# EAGLE design tester (EAGLE 9.2.2)
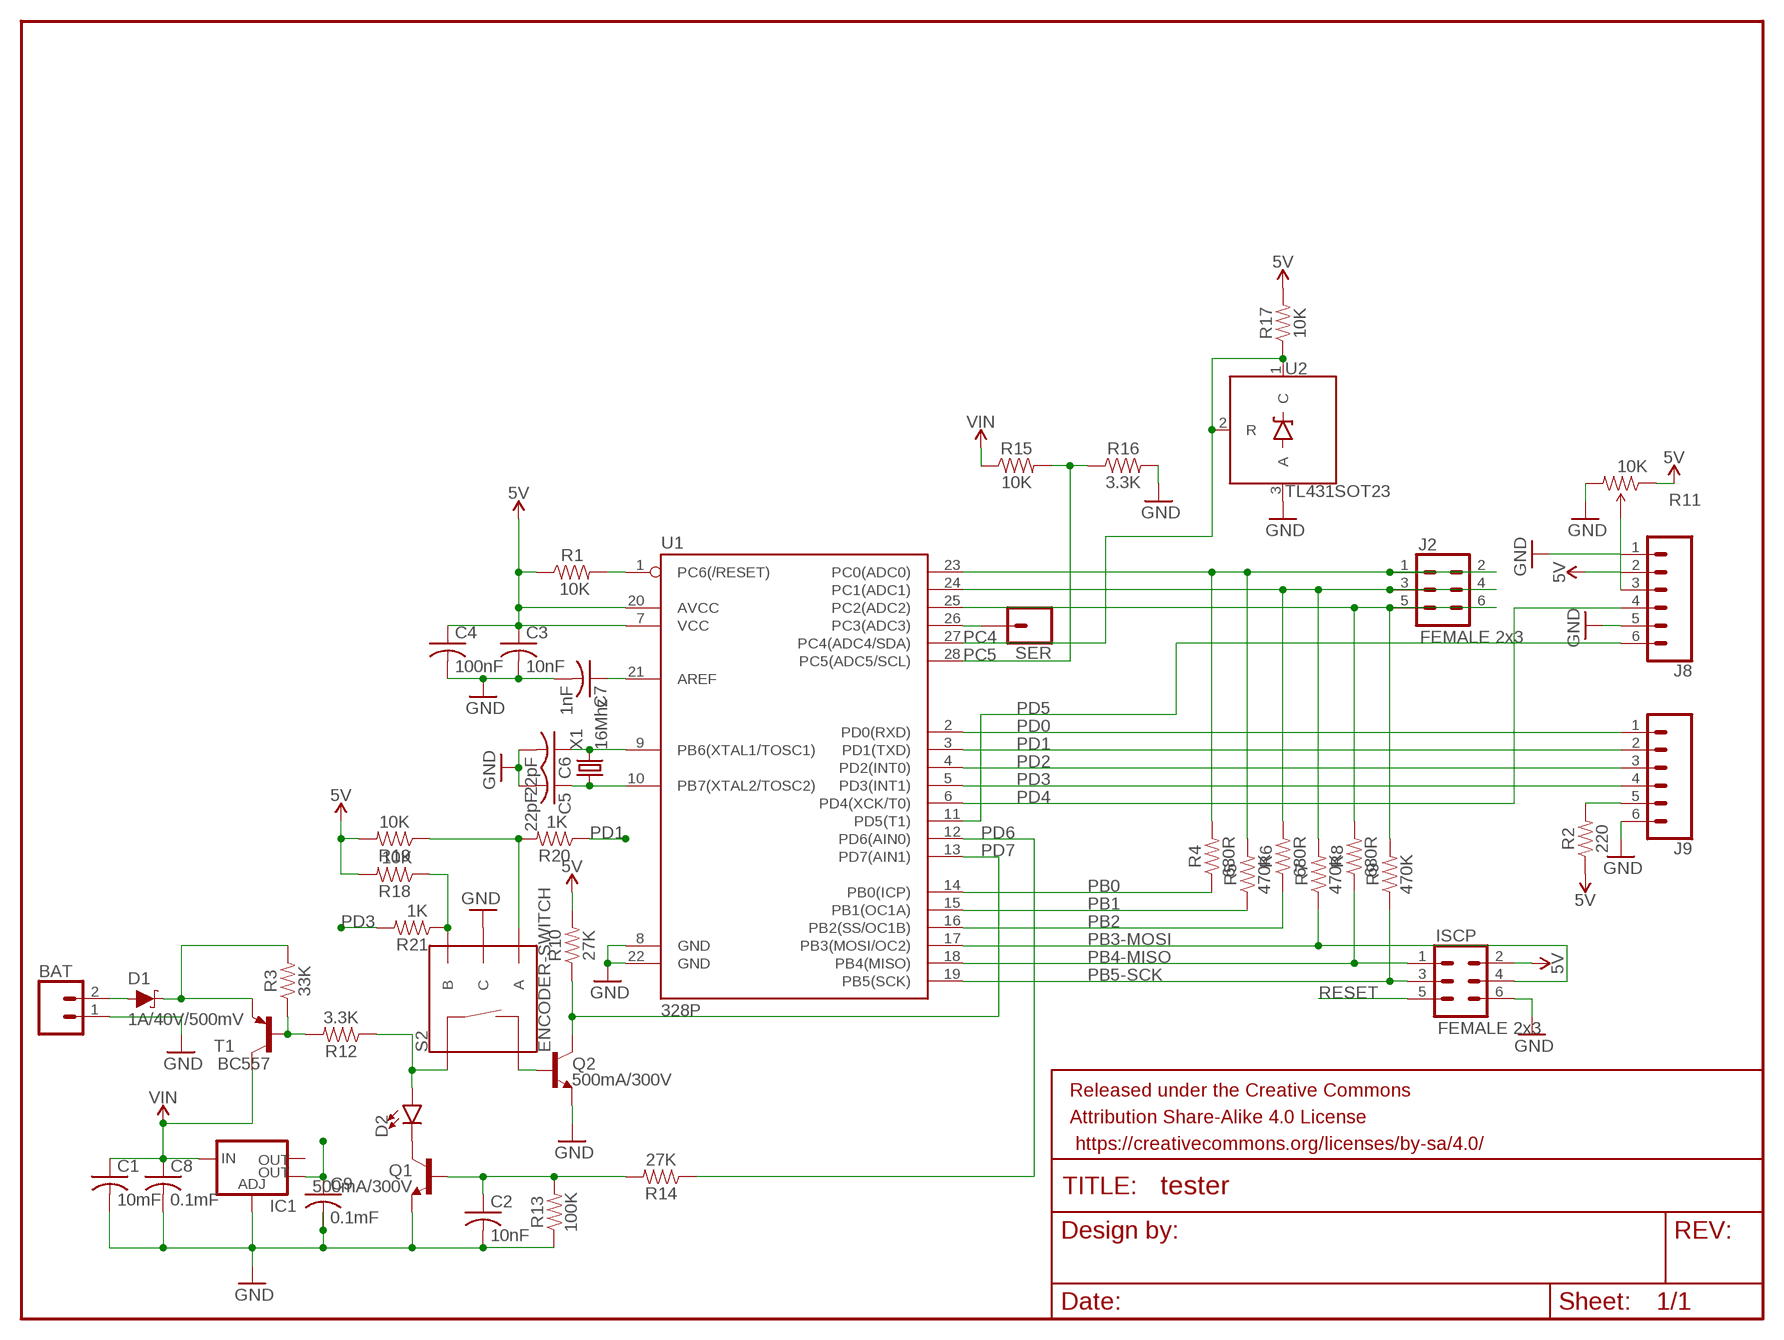
[diagram p0: schematic, sheet 1]

## Parts
BAT  CONN_02  [1X02]
C1  10mF  C-USC0805  [C0805]
C2  10nF  C-USC0805  [C0805]
C3  10nF  C-USC0805  [C0805]
C4  100nF  C-USC0805  [C0805]
C5  22pF  C-USC0805  [C0805]
C6  22pF  C-USC0805  [C0805]
C7  1nF  C-USC0805  [C0805]
C8  0.1mF  C-USC0805  [C0805]
C9  0.1mF  C-USC0805  [C0805]
D1  1A/40V/500mV  DIODE-SCHOTTKY-SS14  [SMA-DIODE]
D2  LED3MM  [LED_3MM]
FRAME1  FRAME-LETTER  [CREATIVE_COMMONS]
IC1  V_REG_LM1117SOT223  [SOT223]
ISCP  FEMALE 2x3  CONN_03X2FEMALE  [2X3]
J2  FEMALE 2x3  CONN_03X2FEMALE  [2X3]
J8  CONN_06SILK_FEMALE_PTH  [1X06]
J9  CONN_06SILK_FEMALE_PTH  [1X06]
Q1  500mA/300V  TRANS_NPN-MMBTA42  [SOT23-3]
Q2  500mA/300V  TRANS_NPN-MMBTA42  [SOT23-3]
R1  10K  RESISTOR0805  [0805]
R2  220  RESISTOR1206  [1206]
R3  33K  RESISTOR1206  [1206]
R4  680R  RESISTORAXIAL-0.3  [AXIAL-0.3]
R5  470K  RESISTORAXIAL-0.3  [AXIAL-0.3]
R6  680R  RESISTORAXIAL-0.3  [AXIAL-0.3]
R7  470K  RESISTORAXIAL-0.3  [AXIAL-0.3]
R8  680R  RESISTORAXIAL-0.3  [AXIAL-0.3]
R9  470K  RESISTORAXIAL-0.3  [AXIAL-0.3]
R10  27K  RESISTOR1206  [1206]
R11  10K  TRIMPOTPTH  [TRIM_POT_PTH]
R12  3.3K  RESISTOR1206  [1206]
R13  100K  RESISTOR0805  [0805]
R14  27K  RESISTOR1206  [1206]
R15  10K  RESISTOR1206  [1206]
R16  3.3K  RESISTOR1206  [1206]
R17  10K  RESISTOR0805  [0805]
R18  10K  RESISTOR0805  [0805]
R19  10K  RESISTOR0805  [0805]
R20  1K  RESISTOR0805  [0805]
R21  1K  RESISTOR0805  [0805]
S2  ENCODER-SWITCH  [ROTARY_ENC_PLAIN]
SER  CONN_01  [1X01]
T1  BC557  BC557A-PNP-TO92-EBC  [TO92-EBC]
U1  328P  ATMEGA328P_PDIP  [DIP28]
U2  TL431SOT23  [SOT23-3]
X1  16Mhz  CRYSTALS-NOGND-HC49  [HC49]

## Nets
5V: C3.1 C4.1 C9.1 IC1.4(OUT) ISCP.2 J8.2 R1.1 R2.1 R10.2 R11.1(CCW) R17.2 R18.2 R19.2 U1.7(VCC) U1.20(AVCC)
GND: BAT.1 C1.2 C2.2 C3.2 C4.2 C5.2 C6.2 C7.2 C8.2 C9.2 IC1.1(ADJ) ISCP.6 J8.1 J8.5 J9.6 Q1.2(E) Q2.2(E) R11.3(CW) R13.1 R16.2 S2.C U1.8(GND) U1.22(GND) U2.3(A)
N$2: C6.1 U1.9(PB6(XTAL1/TOSC1)) X1.2
N$3: C5.1 U1.10(PB7(XTAL2/TOSC2)) X1.1
N$5: C7.1 U1.21(AREF)
N$10: J9.5 R2.2
N$11: J8.3 R11.2(WIPER)
N$13: D2.K(C) Q1.3(C)
N$14: R18.1 R21.1 S2.B
N$18: BAT.2 D1.A
N$20: R3.1 R12.2 T1.B
N$22: C2.1 Q1.1(B) R13.2 R14.2
N$23: D1.C R3.2 T1.E
N$24: D2.A R12.1 S2.SW+
N$25: R19.1 R20.2 S2.A
N$26: Q2.1(B) S2.SW-
PB0: R4.P$1 U1.14(PB0(ICP))
PB1: R5.P$1 U1.15(PB1(OC1A))
PB2: R6.P$1 U1.16(PB2(SS/OC1B))
PB3-MOSI: ISCP.4 R7.P$1 U1.17(PB3(MOSI/OC2))
PB4-MISO: ISCP.1 R8.P$1 U1.18(PB4(MISO))
PB5-SCK: ISCP.3 R9.P$1 U1.19(PB5(SCK))
PC4: R17.1 U1.27(PC4(ADC4/SDA)) U2.1(C) U2.2(R)
PC5: R15.2 R16.1 U1.28(PC5(ADC5/SCL))
PD0: J9.1 U1.2(PD0(RXD))
PD1: J9.2 R20.1 U1.3(PD1(TXD))
PD2: J9.3 U1.4(PD2(INT0))
PD3: J9.4 R21.2 U1.5(PD3(INT1))
PD4: J8.4 U1.6(PD4(XCK/T0))
PD5: J8.6 U1.11(PD5(T1))
PD6: R14.1 U1.12(PD6(AIN0))
PD7: Q2.3(C) R10.1 U1.13(PD7(AIN1))
RESET: ISCP.5 R1.2 U1.1(PC6(/RESET))
SERIAL: SER.1 U1.26(PC3(ADC3))
TP1: J2.1 J2.2 R4.P$2 R5.P$2 U1.23(PC0(ADC0))
TP2: J2.3 J2.4 R6.P$2 R7.P$2 U1.24(PC1(ADC1))
TP3: J2.5 J2.6 R8.P$2 R9.P$2 U1.25(PC2(ADC2))
VIN: C1.1 C8.1 IC1.3(IN) R15.1 T1.C
Unconnected: IC1.2(OUT)

## Library data of the parts
BAT = SparkFun-Connectors:CONN_02: Multi connection point. Often used as Generic Header-pin footprint for 0.1 inch spaced/style header connections On any of the 0.1 inch spaced packages, you can populate with these: Break Away Headers - Straight <https://www.sparkfun.com/products/116> (PRT-00116) Break Away Male Headers - Right Angle <https://www.sparkfun.com/products/553> (PRT-00553) Female Headers <https://www.sparkfun.com/products/115> (PRT-00115) Break Away Headers - Machine Pin <https://www.sparkfun.com/products/117> (PRT-00117) Break Away Female Headers - Swiss Machine Pin <https://www.sparkfun.com/products/743> (PRT-00743) For SCREWTERMINALS and SPRING TERMINALS visit here: Screw Terimnals on SparkFun.com <https://www.sparkfun.com/search/results?term=Screw+Terminals> (5mm/3.5mm/2.54mm spacing) This device is also useful as a general connection point to wire up your design to another part of your project. Our various solder wires solder well into these plated through hole pads. Hook-Up Wire - Assortment (Stranded, 22 AWG) <https://www.sparkfun.com/products/11375> (PRT-11375) Hook-Up Wire - Assortment (Solid Core, 22 AWG) <https://www.sparkfun.com/products/11367> (PRT-11367) View the entire wire category on our website here <https://www.sparkfun.com/categories/141> Special notes: Molex polarized connector foot print use with: PRT-08233 with associated crimp pins and housings. 2.54_SCREWTERM for use with PRT-10571. 3.5mm Screw Terminal footprints for PRT-08084 5mm Screw Terminal footprints for use with PRT-08432
C1-C9 = rcl:C-US: CAPACITOR, American symbol; SPICEPREFIX: C
D1 = SparkFun-DiscreteSemi:DIODE-SCHOTTKY: Schottky diode A Schottky diode is a semiconductor diode which has a low forward voltage drop and a very fast switching action.; PROD_ID: DIO-08053
D2 = SparkFun-LED:LED: LED (Generic) Standard schematic elements and footprints for 5mm, 3mm, 1206, and 0603 sized LEDs. Generic LEDs with no color specified.; PROD_ID: DIO-08794
FRAME1 = SparkFun-Aesthetics:FRAME-LETTER: Schematic Frame - Letter Standard 8.5x11 US Letter frame
IC1 = SparkFun-IC-Power:V_REG_LM1117: Voltage Regulator LM1117 Standard adjustable voltage regulator but in SMD form. Spark Fun Electronics SKU : COM-00595; PROD_ID: VREG-08170
ISCP J2 = SparkFun-Connectors:CONN_03X2: Multi connection point. Often used as Generic Header-pin footprint for 0.1 inch spaced/style header connections You can populate with any combo of single row headers, but if you'd like an exact match, check these: Header - 2x3 (Male, 0.1") <https://www.sparkfun.com/products/12807> (PRT-12807) Header - 2x3 (Female, 0.1") <https://www.sparkfun.com/products/13010> (PRT-13010) 2x3 Pin Shrouded Header <https://www.sparkfun.com/products/10877> (PRT-10877) On any of the 0.1 inch spaced packages, you can populate with these: Break Away Headers - Straight <https://www.sparkfun.com/products/116> (PRT-00116) Break Away Male Headers - Right Angle <https://www.sparkfun.com/products/553> (PRT-00553) Female Headers <https://www.sparkfun.com/products/115> (PRT-00115) Break Away Headers - Machine Pin <https://www.sparkfun.com/products/117> (PRT-00117) Break Away Female Headers - Swiss Machine Pin <https://www.sparkfun.com/products/743> (PRT-00743) Special note: the shrouded connector mates well with our 3x2 ribbon cables: Ribbon Crimp Connector - 6-pin (2x3, Female) <https://www.sparkfun.com/products/10651> (PRT-10651) Ribbon Cable - 6 wire (15ft) <https://www.sparkfun.com/products/10646> (PRT-10646); PROD_ID: CONN-11566
J8 J9 = SparkFun-Connectors:CONN_06: Multi connection point. Often used as Generic Header-pin footprint for 0.1 inch spaced/style header connections On any of the 0.1 inch spaced packages, you can populate with these: Break Away Headers - Straight <https://www.sparkfun.com/products/116> (PRT-00116) Break Away Male Headers - Right Angle <https://www.sparkfun.com/products/553> (PRT-00553) Female Headers <https://www.sparkfun.com/products/115> (PRT-00115) Break Away Headers - Machine Pin <https://www.sparkfun.com/products/117> (PRT-00117) Break Away Female Headers - Swiss Machine Pin <https://www.sparkfun.com/products/743> (PRT-00743) Arduino Stackable Header - 6 Pin <https://www.sparkfun.com/products/9280> (PRT-09280) For SCREWTERMINALS and SPRING TERMINALS visit here: Screw Terimnals on SparkFun.com <https://www.sparkfun.com/search/results?term=Screw+Terminals> (5mm/3.5mm/2.54mm spacing) This device is also useful as a general connection point to wire up your design to another part of your project. Our various solder wires solder well into these plated through hole pads. Hook-Up Wire - Assortment (Stranded, 22 AWG) <https://www.sparkfun.com/products/11375> (PRT-11375) Hook-Up Wire - Assortment (Solid Core, 22 AWG) <https://www.sparkfun.com/products/11367> (PRT-11367) View the entire wire category on our website here <https://www.sparkfun.com/categories/141>; PROD_ID: CONN-08437
Q1 Q2 = SparkFun-DiscreteSemi:TRANS_NPN: NPN transistor Current controlled devices typically used to amplify current or used as a switch. BC547 - COM-08928 <http://www.sparkfun.com/products/8928> (TO-92 45V 100mA) (1.Collector 2.Base 3.Emitter) 2N3904 - COM-00521 <http://www.sparkfun.com/products/521> (TO-92 40V 200mA) (1.Emitter 2.Base 3.Collector) P2N2222A - COM-12852 <http://www.sparkfun.com/products/12852> (TO-92 40V 600mA) (1.Collector 2.Base 3.Emitter); PROD_ID: TRANS-09116
R1-R10 R12-R21 = SparkFun-Resistors:RESISTOR: Generic Resistor Package
R11 = SparkFun-Retired:TRIMPOT: Various small potentiometers for "set-and-forget" applications; PROD_ID: RES-08445
S2 = SparkFun-Switches:ENCODER-SWITCH: Rotary Encoder w/ Select Switch Encoders rotate similarly to potentiometers, but they’re different from potentiometers in that an encoder has full rotation without limits. They output gray code so that you can tell how much and in which direction the encoder has been turned. This encoder includes a push-down select switch built into the shaft. SparkFun Products Rotary Encoder <https://www.sparkfun.com/products/9117> (COM-09117); SF_SKU: COM-09117
SER = SparkFun-Connectors:CONN_01: Single connection point. Often used as Generic Header-pin footprint for 0.1 inch spaced/style header connections On any of the 0.1 inch spaced packages, you can populate with these: Break Away Headers - Straight <https://www.sparkfun.com/products/116> (PRT-00116) Break Away Male Headers - Right Angle <https://www.sparkfun.com/products/553> (PRT-00553) Female Headers <https://www.sparkfun.com/products/115> (PRT-00115) Break Away Headers - Machine Pin <https://www.sparkfun.com/products/117> (PRT-00117) Break Away Female Headers - Swiss Machine Pin <https://www.sparkfun.com/products/743> (PRT-00743) This device is also useful as a general connection point to wire up your design to another part of your project. Our various solder wires solder well into these plated through hole pads. Hook-Up Wire - Assortment (Stranded, 22 AWG) <https://www.sparkfun.com/products/11375> (PRT-11375) Hook-Up Wire - Assortment (Solid Core, 22 AWG) <https://www.sparkfun.com/products/11367> (PRT-11367) View the entire wire category on our website here <https://www.sparkfun.com/categories/141> Special notes: SMTSO-256-ET is a "flush mount" nut for a 4-40 screw. We mostly use this on specialty testbeds; it is a nice way to connect hardware to your PCB at an adjustable hieght. Also note, the SNAP packages are for using a snappable style connector. We sell a baggie of snaps and they are also used on two LilyPad designs: Snap Assortment - 30 pack (male and female) <https://www.sparkfun.com/products/11347> (DEV-11347) LilyPad Arduino SimpleSnap <https://www.sparkfun.com/products/10941> (DEV-10941) LilyPad SimpleSnap Protoboard <https://www.sparkfun.com/products/10940> (DEV-10940)
T1 = transistor:*-PNP-: PNP Transistror
U1 = SparkFun-IC-Microcontroller:ATMEGA328P_PDIP: Atmel 328P Through hole ATMEGA328P uC used in the Arduino 32kb flash, 1k EEPROM, 2k SRAM Datasheet <http://www.sparkfun.com/datasheets/Components/SMD/ATMega328.pdf> SparkFun Products Storefront component: AVR 28 Pin 20MHz 32K 6A/D - ATMega328P <https://www.sparkfun.com/products/9061> (COM-09061) SparkFun Simon Says - Through-Hole Soldering Kit <https://www.sparkfun.com/products/10547> (KIT-10547) SparkFun Learn to Solder - Simon Says <https://www.sparkfun.com/products/13708> (KIT-13708) SparkFun BigTime Watch Kit <https://www.sparkfun.com/products/11734> (KIT-11734) SparkFun ClockIt <https://www.sparkfun.com/products/10930> (KIT-10930) SparkFun Serial Enabled LCD Kit <https://www.sparkfun.com/products/10097> (LCD-10097) SparkFun Simon Tilts - Through Hole Soldering Kit <https://www.sparkfun.com/products/12634> (KIT-12634) SparkFun Frequency Counter Kit <https://www.sparkfun.com/products/10140> (KIT-10140) FabFM Radio Kit <https://www.sparkfun.com/products/11043> (KIT-11043) SparkFun Binary Blaster Kit <https://www.sparkfun.com/products/12037> (KIT-12037) SparkFun Metro-Gnome <https://www.sparkfun.com/products/9236> (KIT-09236) ATmega328 with Arduino Optiboot (Uno) <https://www.sparkfun.com/products/10524> (DEV-10524); PROD_ID: IC-09136
U2 = SparkFun-DiscreteSemi:TL431: TL431- Voltage Reference Precision Programmable Shunt Regulator Diode Datasheet <https://cdn.sparkfun.com/datasheets/Components/General%20IC/TL431-D.pdf> SparkFun Products: TL431-Voltage Reference PTH <https://www.sparkfun.com/products/11078> SparkFun Uh-Oh Battery Level Indicator <https://www.sparkfun.com/products/11087>
X1 = IQD-Frequency-Products:CRYSTALS-NOGND: CRYSTALS CAN NOT GROUNDED

## Board
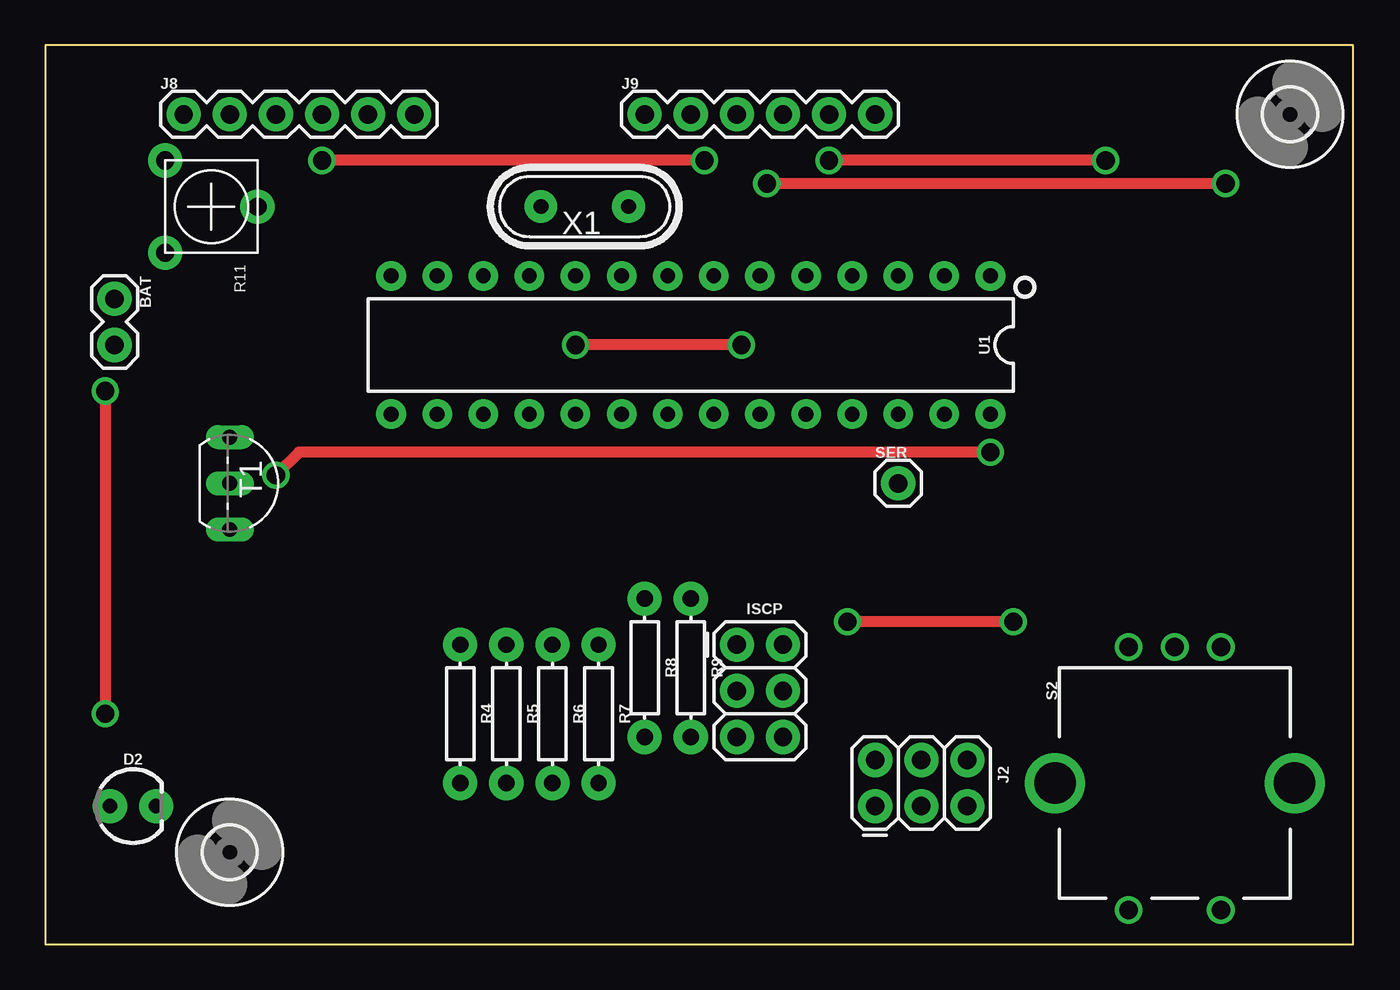
[diagram p1: board, top side]
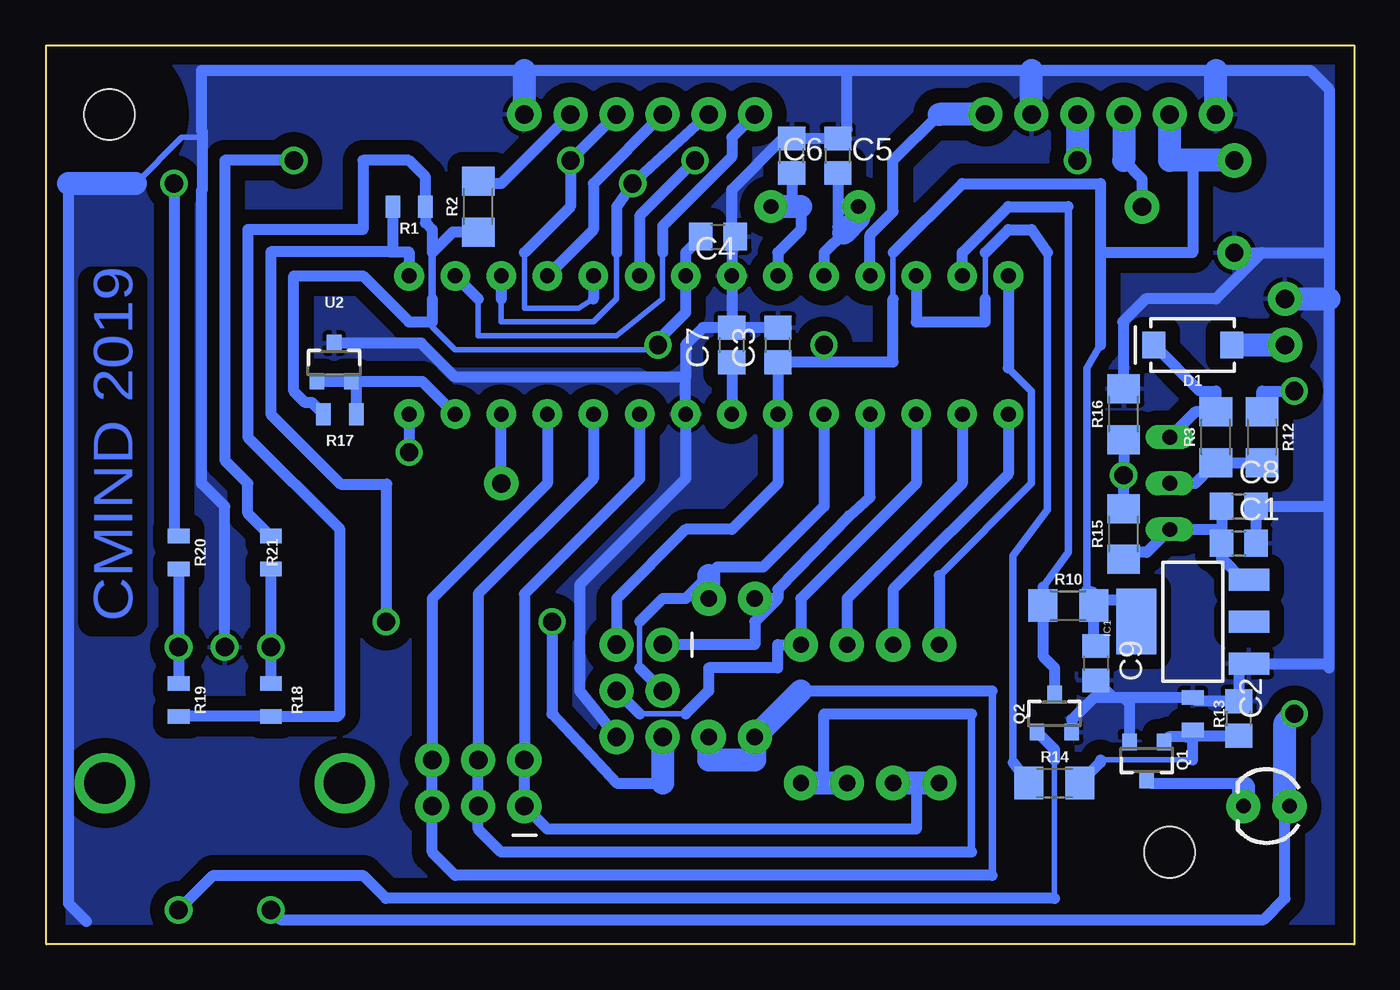
[diagram p2: board, bottom side, seen from below]

Size 72.06 x 49.52 mm. Coordinates in mm from the lower left corner, seen from the top.
Outline: 0,0 72.06,0 72.06,49.52 0,49.52 0,0
Copper layers (1*16): Top 0.035mm / dielectric 1.5mm / Bottom 0.035mm
Design rules "default": minimum track width 6mil, minimum drill 0.35mm, track to track 6mil, track to pad 6mil, pad to pad 6mil, via to via 6mil, smd to smd 6mil, copper to edge 40mil, drill to drill 6mil, minimum pad ring 10mil, minimum via ring 8mil, stop-mask expansion 4mil, vias tented up to drill 0mil, thermal gap 10mil

### Footprints (pad centres in the part's own frame; a part is rotated, then mirrored left to right if it is on the bottom)
1X02 = drill 1.016 pad 1.88: 1 0,0; 2 2.54,0
C0805 = smd 1.3 x 1.5: 1 -0.95,0; 2 0.95,0
SMA-DIODE = smd 1.27 x 1.47: A -2.15,0; C 2.15,0
LED_3MM = drill 0.813 pad 1.88: A -1.27,0; K 1.27,0
SOT223 = smd 1.219 x 2.235: 1 -2.311,-3.099; 2 0,-3.099; 3 2.311,-3.099 | smd 3.6 x 2.2: 4 0,3.099
2X3 = drill 1.016 pad 1.88: 1 0,0; 2 0,2.54; 3 2.54,0; 4 2.54,2.54; 5 5.08,0; 6 5.08,2.54
1X06 = drill 1.016 pad 1.88: 1 0,0; 2 2.54,0; 3 5.08,0; 4 7.62,0; 5 10.16,0; 6 12.7,0
SOT23-3 = smd 0.8 x 0.9: 1 -0.95,-1; 2 0.95,-1; 3 0,1.1
0805 = smd 0.8 x 1.2: 1 -0.9,0; 2 0.9,0
1206 = smd 1.6 x 1.8: 1 -1.4,0; 2 1.4,0
AXIAL-0.3 = drill 0.9 pad 1.88: P$1 -3.81,0; P$2 3.81,0
TRIM_POT_PTH = drill 1 pad 1.88: 1 -2.54,-2.54; 2 0,2.54; 3 2.54,-2.54
ROTARY_ENC_PLAIN = drill 1.016: A 7.493,-2.54; B 7.493,2.54; C 7.493,0; SW+ -6.985,2.54; SW- -6.985,-2.54 | drill 2.286: P$3 0,6.604; P$4 0,-6.604
1X01 = drill 1.016 pad 1.88: 1 0,0
TO92-EBC = drill 0.813 long: B 0,-1.27; C 2.54,-1.27; E -2.54,-1.27
DIP28 = drill 0.813 pad 1.626: 1 -16.51,-3.81; 2 -13.97,-3.81; 3 -11.43,-3.81; 4 -8.89,-3.81; 5 -6.35,-3.81; 6 -3.81,-3.81; 7 -1.27,-3.81; 8 1.27,-3.81; 9 3.81,-3.81; 10 6.35,-3.81; 11 8.89,-3.81; 12 11.43,-3.81; 13 13.97,-3.81; 14 16.51,-3.81; 15 16.51,3.81; 16 13.97,3.81; 17 11.43,3.81; 18 8.89,3.81; 19 6.35,3.81; 20 3.81,3.81; 21 1.27,3.81; 22 -1.27,3.81; 23 -3.81,3.81; 24 -6.35,3.81; 25 -8.89,3.81; 26 -11.43,3.81; 27 -13.97,3.81; 28 -16.51,3.81
2,8 = hole 2.8: 0,0
HC49 = drill 0.813 pad 1.8: 1 -2.413,0; 2 2.413,0

### Placement (x,y rotation side)
BAT  3.81,35.56 270 top
C1  6.35,22.1 0 bottom
C2  6.35,12.45 90 bottom
C3  31.75,33.02 90 bottom
C4  35.05,38.99 0 bottom
C5  28.45,43.43 90 bottom
C6  30.99,43.43 90 bottom
C7  34.29,33.02 90 bottom
C8  6.35,24.13 0 bottom
C9  14.22,15.49 270 bottom
D1  8.89,33.02 180 bottom
D2  4.83,7.62 0 top
FRAME1  2.54,-7.62 0 top  (outside the outline)
IC1  8.89,17.78 90 bottom
ISCP  38.1,16.51 270 top
J2  45.72,7.62 0 top
J8  7.62,45.72 0 top
J9  33.02,45.72 0 top
Q1  11.43,10.16 180 bottom
Q2  16.51,12.7 0 bottom
R1  52.07,40.64 180 bottom
R2  48.26,40.64 90 bottom
R3  7.62,27.94 90 bottom
R4  22.86,12.7 270 top
R5  25.4,12.7 270 top
R6  27.94,12.7 270 top
R7  30.48,12.7 270 top
R8  33.02,15.24 270 top
R9  35.56,15.24 270 top
R10  15.75,18.67 0 bottom
R11  9.14,40.64 270 top
R12  5.08,27.94 270 bottom
R13  8.89,12.7 270 bottom
R14  16.51,8.89 0 bottom
R15  12.7,22.61 90 bottom
R16  12.7,29.21 90 bottom
R17  55.88,29.21 180 bottom
R18  59.69,13.46 270 bottom
R19  64.77,13.46 270 bottom
R20  64.77,21.59 270 bottom
R21  59.69,21.59 90 bottom
S2  62.23,8.89 90 top
SER  46.99,25.4 0 top
T1  11.43,25.4 270 top
U1  35.56,33.02 180 top
U2  56.2,32.02 0 bottom
U$1  [2,8]  10.16,5.08 0 top
U$2  [2,8]  68.58,45.72 0 top
X1  29.72,40.64 0 top

### Tracks (layer width: path | path; a pad name or v marks a point on that pad's centre or on a via)
5V  (via drill 1)
  Top 0.61: v38.35,33.02 v29.21,33.02
  Bottom 0.305: 38.1,32.77 49.53,32.77 50.8,34.04 50.8,34.29 | 25.4,35.56 25.4,38.1
  Bottom 0.406: 50.8,38.1 50.8,35.56 | 13.97,33.02 14.73,31.75 14.73,19.49
  Bottom 0.61: R2.1 49.66,39.24 50.8,38.1 50.8,39.37 51.17,39.74 R1.1 51.17,42.28 52.07,43.18 54.61,43.18 54.61,39.37 60.96,39.37 60.96,27.94 55.88,22.86 55.88,12.7 56.02,12.56 R18.2 R19.2 | C4.1 36,38.93 36.83,38.1 U1.7 36.83,34.8 38.1,33.53 v38.35,33.02 38.1,32.77 | 8.89,43.18 8.89,38.1 13.97,38.1 | R17.2 57.41,29.84 57.78,29.84 58.42,30.48 58.42,36.83 54.61,36.83 52.07,34.29 50.8,34.29 50.8,35.56 | 29.21,32.07 25.4,32.07 25.4,35.56 | 29.21,32.07 C3.1 U1.20 31.75,25.4 34.29,22.86 36.83,22.86 40.64,19.05 ISCP.2 | v29.21,33.02 29.21,32.07 | 25.4,38.1 21.59,41.91 13.97,41.91 13.97,38.1 | 13.97,38.1 13.97,33.02 | 11.5,18.98 13.91,18.98 R10.2 | R10.2 14.35,19.36 14.73,19.49 | R10.2 14.35,16.57 C9.1 | IC1.4 11.43,17.78
  Bottom 0.813: 11.5,18.98 11.43,19.05 11.43,17.78
  Bottom 1.27: J8.2 10.16,43.18 8.89,43.18 R11.1
GND
  Bottom 0.305: 63.45,44.45 64.61,44.45 67.15,41.91
  Bottom 0.61: 34.29,38.24 34.29,41.58 31.49,44.38 C6.2 C5.2 27.94,44.89 27.94,48.15 | 34.29,38.24 U1.8 C7.2 | C4.2 34.1,38.43 34.29,38.24 | 1.37,24.13 1.37,15.24 1.6,15.47 IC1.1 6.35,14.91 C2.2 8.69,13.4 R13.1 12.7,13.6 | 1.37,24.13 1.37,35.56 1.37,38.1 | 1.37,38.1 1.37,47.09 2.43,48.15 7.62,48.15 17.78,48.15 27.94,48.15 | 27.94,48.15 45.72,48.15 63.5,48.15 63.5,44.83 63.45,44.78 63.45,44.45 63.45,41.58 63.5,41.53 63.5,25.4 62.23,24.13 S2.C | R11.3 5.08,38.1 | 5.08,38.1 1.37,38.1 | 5.08,38.1 7.62,35.56 11.48,35.56 12.75,34.29 12.7,34.24 R16.2 | 1.37,24.13 C8.2 C1.2 | C3.2 C7.2 | C7.2 35.88,33.97 36.83,33.02 36.83,31.24 | 36.83,31.24 49.53,31.24 51.41,33.12 U2.3 | 12.7,13.6 13.28,13.6 | 13.28,13.6 C9.2 | 13.28,13.6 14.34,13.6 15.56,12.38 Q2.2 | 12.7,13.6 12.38,13.28 Q1.2 | 36.83,31.24 U1.22 36.83,25.65 42.67,19.81 42.67,13.97 ISCP.6 | 70.84,41.91 70.84,2.26 69.85,1.27
  Bottom 1.27: J8.5 17.78,48.15 | J9.6 45.72,48.15 | BAT.1 1.37,35.56 | J8.1 7.62,48.15 | 67.15,41.91 70.84,41.91
  pour Bottom (isolate 0.813): 0,49.53 72.39,49.53 72.39,0 0,0
N$2
  Bottom 0.61: U1.9 31.75,38.1 30.48,39.37 30.48,40.64 30.99,41.15 C6.1
  Bottom 1.27: 30.48,40.64 X1.2
N$3
  Bottom 0.61: U1.10 29.21,38.1 28.12,39.19 28.45,39.51 C5.1
  Bottom 1.27: X1.1 27.3,40.01 28.12,39.19
N$5
  Bottom 0.61: C7.1 U1.21
N$10
  Bottom 0.61: J9.5 46.99,41.91 48.13,41.91 R2.2
N$11
  Bottom 0.61: 12.7,43.18 11.68,42.16 R11.2
  Bottom 1.27: J8.3 12.7,43.18
N$13
  Bottom 0.61: Q1.3 11.26,8.89 6.35,8.89 6.1,8.64
  Bottom 1.27: 6.1,8.64 D2.K
N$14
  Bottom 0.61: R21.1 S2.B R18.1
N$18
  Bottom 1.27: D1.A BAT.2
N$20
  Bottom 0.61: T1.B 8.76,25.4 R3.1 R12.2
N$22
  Bottom 0.305: 13.97,10.16 8.89,10.16
  Bottom 0.61: R14.2 13.97,10.03 13.97,10.16 | 8.89,10.16 R13.2 | R13.2 8.59,11.5 C2.1 | R13.2 9.26,11.43 10.21,11.43 Q1.1
N$23
  Bottom 0.61: D1.C 8.5,30.48 7.62,30.48 R3.2 8.76,29.34 T1.E
N$24  (via drill 1)
  Top 0.61: v3.3,30.48 v3.3,12.7
  Bottom 0.61: R12.1 5.08,30.48 v3.3,30.48 | S2.SW+ 59.16,1.37 4.98,1.37 3.81,2.54 3.81,7.62
  Bottom 1.27: v3.3,12.7 3.81,12.19 3.81,7.62 D2.A
N$25
  Bottom 0.61: R20.2 S2.A R19.1
N$26
  Bottom 0.305: 16.51,10.16 16.51,2.54
  Bottom 0.61: S2.SW- 62.87,3.81 54.61,3.81 53.34,2.54 16.51,2.54 | Q2.1 16.51,10.75 16.51,10.16
PB0
  Bottom 0.406: 19.05,31.75 17.78,30.48 17.78,25.4 22.86,20.32
  Bottom 0.61: U1.14 19.05,31.75 | 22.86,20.32 R4.P$1
PB1
  Bottom 0.61: U1.15 19.05,25.91 25.4,19.56 R5.P$1
PB2
  Bottom 0.61: U1.16 21.59,25.4 27.94,19.05 R6.P$1
PB3-MOSI
  Bottom 0.305: 36.83,12.7 39.37,12.7
  Bottom 0.61: U1.17 24.13,25.4 30.48,19.05 R7.P$1 31.75,16.51 31.75,15.24 35.56,15.24 35.56,13.97 36.83,12.7 | 39.37,12.7 ISCP.4
PB4-MISO
  Bottom 0.61: 31.75,19.05 R8.P$1 | 31.75,19.05 33.02,17.78 33.02,16.51 ISCP.1 | 31.75,19.05 31.75,19.56 27.81,23.62 26.67,24.64 U1.18
PB5-SCK
  Bottom 0.305: 39.37,17.78 39.37,15.24
  Bottom 0.61: U1.19 29.21,24.13 32.56,20.78 35.1,20.78 35.56,20.32 36.83,19.05 38.1,19.05 39.37,17.78 | 39.37,15.24 ISCP.3
  Bottom 1.27: 35.56,20.32 R9.P$1
PC4
  Bottom 0.61: U2.1 U2.2 | U2.2 54.98,30.75 R17.1 | U2.2 51.34,31.02 U1.27
PC5  (via drill 1 pad 0.65)
  Top 0.61: v52.07,27.11 13.97,27.11 v12.7,25.84
  Bottom 0.61: U1.28 v52.07,27.11 | R16.1 v12.7,25.84 R15.2
PD0
  Bottom 0.305: 38.1,38.1 38.1,35.56 40.64,33.53 48.26,33.53 48.26,35.56
  Bottom 0.61: 38.1,38.1 38.1,39.56 34.29,43.37 34.29,44.45 J9.1 | 48.26,35.56 U1.2
PD1  (via drill 1)
  Top 0.61: v65.02,41.91 v39.75,41.91
  Bottom 0.305: 46.99,35.56 46.99,34.29 41.91,34.29 40.64,35.56 40.64,38.1
  Bottom 0.61: U1.3 46.99,35.56 | J9.2 v39.75,41.91 40.64,40.64 40.64,38.1 | v65.02,41.91 65.02,22.74 R20.1
PD2
  Bottom 0.61: J9.3 41.91,41.91 41.91,39.37 U1.4
PD3  (via drill 1)
  Top 0.61: v58.42,43.18 v43.18,43.18
  Bottom 0.305: 45.72,38.1 45.72,35.05 42.72,35.05 41.91,35.56
  Bottom 0.61: U1.5 41.91,35.56 | J9.4 v43.18,43.18 43.18,40.64 45.72,38.1 | R21.2 60.96,23.76 60.96,25.4 62.23,26.67 62.23,43.18 v58.42,43.18
PD4  (via drill 1 pad 0.85)
  Top 0.61: v36.32,43.18 v15.24,43.18
  Bottom 0.61: v36.32,43.18 39.37,40.13 U1.6
  Bottom 1.27: J8.4 v15.24,43.18
PD5
  Bottom 0.61: 22.86,45.72 25.4,43.18 25.4,40.37 26.67,39.09 U1.11
  Bottom 1.27: J8.6 22.86,45.72
PD6
  Bottom 0.305: 20.32,35.56 20.32,38.1
  Bottom 0.406: 16.89,38.1 16.89,23.94 18.8,21.4 18.8,10.03
  Bottom 0.61: U1.12 24.13,34.29 20.32,34.29 20.32,35.56 | 20.32,38.1 19.05,39.37 17.78,39.37 16.89,38.1 | 18.8,10.03 R14.1
PD7
  Bottom 0.406: 15.75,40.64 15.75,21.59 17.15,19.68
  Bottom 0.61: U1.13 21.59,38.1 19.05,40.64 15.75,40.64 | 17.15,19.68 R10.1 17.15,15.88 16.51,15.24 Q2.3
RESET  (via drill 1)
  Top 0.61: v53.34,17.78 v44.2,17.78
  Bottom 0.61: U1.1 52.07,38.15 53.14,38.15 | 53.14,38.15 59.69,38.15 59.69,29.21 55.83,25.35 53.29,25.35 53.34,25.3 v53.34,17.78 | R1.2 52.97,38.32 53.14,38.15 | v44.2,17.78 44.2,12.7 40.64,8.89 38.1,8.89
  Bottom 1.27: ISCP.5 38.1,8.89
SERIAL
  Bottom 0.61: SER.1 U1.26
TP1
  Bottom 0.61: U1.23 39.37,25.65 45.72,19.3 J2.2 J2.1 44.45,6.35 24.13,6.35 24.13,8.89
  Bottom 1.27: R4.P$2 24.13,8.89 R5.P$2
TP2
  Bottom 0.406: 21.08,12.7 21.08,5.08
  Bottom 0.61: U1.24 41.91,25.65 48.26,19.3 J2.4 J2.3 48.26,6.35 46.99,5.08 21.08,5.08 | 29.21,8.89 29.21,12.7 21.08,12.7
  Bottom 1.27: R6.P$2 29.21,8.89 R7.P$2
TP3
  Bottom 0.406: 19.94,13.97 19.94,3.81
  Bottom 0.61: U1.25 44.45,25.4 50.8,19.05 J2.6 J2.5 50.8,5.08 49.53,3.81 19.94,3.81 | 30.48,13.97 19.94,13.97
  Bottom 1.27: R9.P$2 35.56,10.16 33.02,10.16 R8.P$2 30.48,13.97
VIN
  Bottom 0.61: C8.1 7.3,22.86 | 7.3,22.86 C1.1 7.3,21.27 6.12,20.09 IC1.3 | 7.3,22.86 T1.C 11.43,21.59 12.57,21.59 R15.1

### Text on the board
Bottom: CMIND 2019
tDocu: 1 | LCD | 16 | BAT | SO / SCK / RST | AVR Component / Tester | 5V / SI / G | TP 1 / TP 2 / TP 3 | TP 1 / TP 2 / TP 3